# Altium schematic sheet Water_Level_Indicator_shematic.SchDoc
size A4; SheetNumber: 1; SheetTotal: 1; SPICEModelCacheLQCHODQK: <root> / <DocumentId>LQCHODQK</DocumentId> / </root>
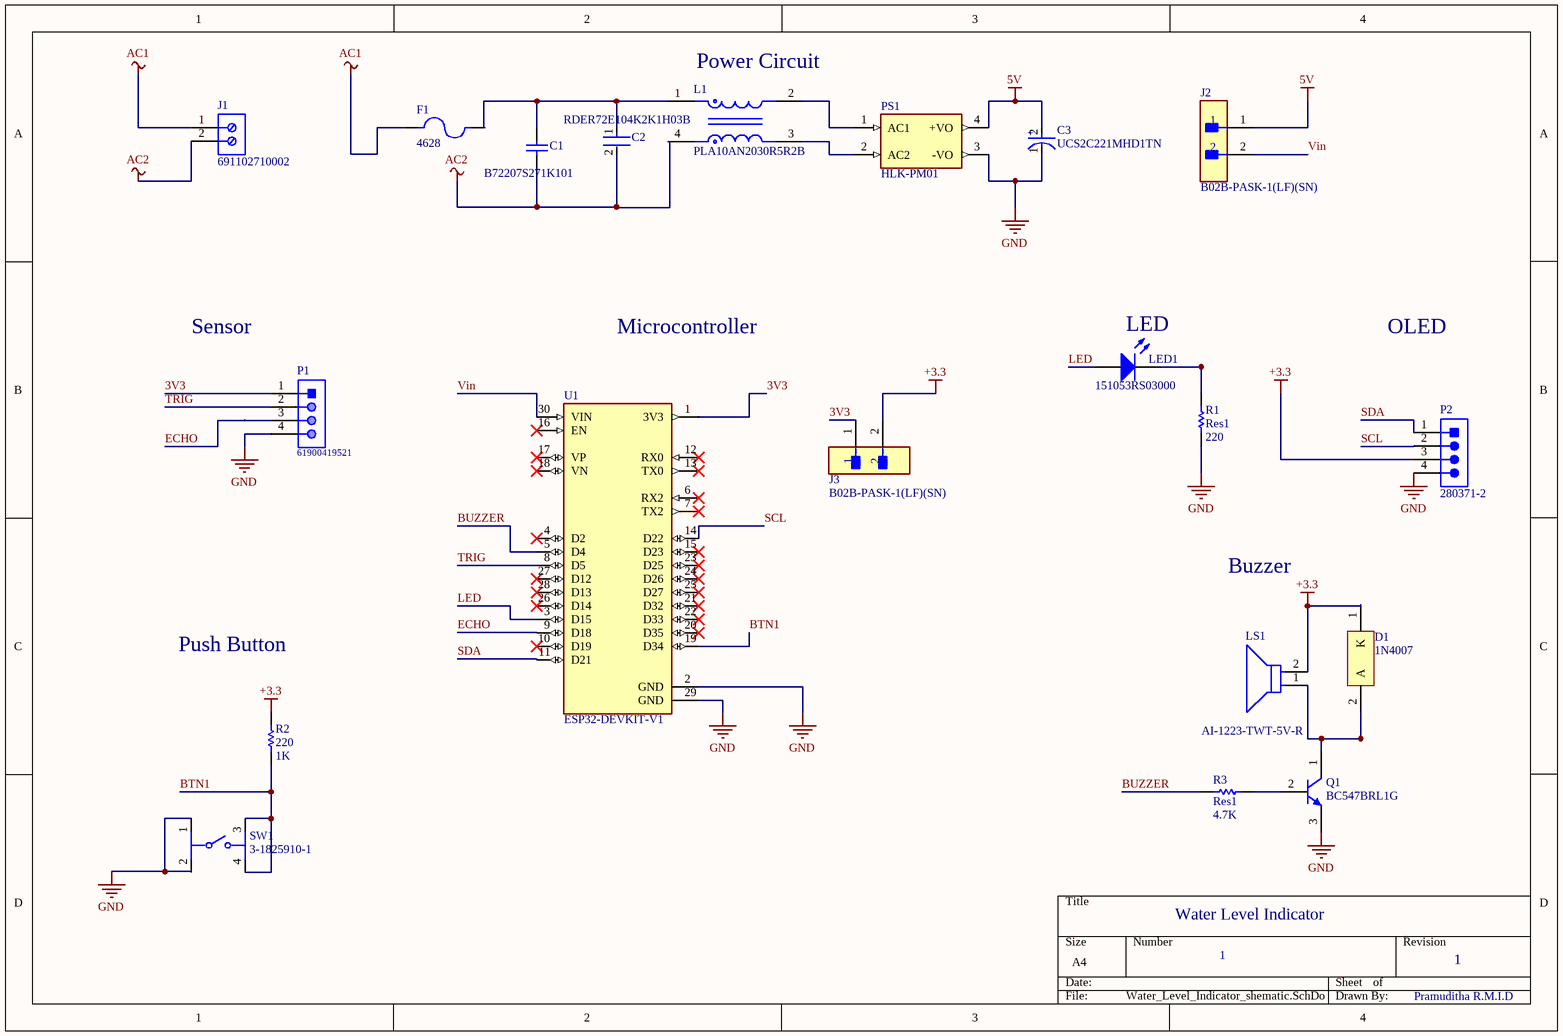
[diagram p0: Water_Level_Indicator_shematic.SchDoc]

## Parts
C1  B72207S271K101  [TDK-S07K275]
C2  RDER72E104K2K1H03B  [FP-RDE2M1-MFG]
C3  UCS2C221MHD1TN  [FP-UCS2C221MHD1TN-MFG]
D1  1N4007  [ONSC-AXIAL_LEAD-2-59-10_P]
F1  4628  [FUSE_4628]
J1  691102710002  [691102710002]
J2  B02B-PASK-1(LF)(SN)  [FP-B02B-PASK-1_LF_SN-MFG]
J3  B02B-PASK-1(LF)(SN)  [FP-B02B-PASK-1_LF_SN-MFG]
L1  PLA10AN2030R5R2B  [FP-PLA10A-PLH10A-MFG]
LED1  151053RS03000  [Type 5mm]
LS1  AI-1223-TWT-5V-R  [FP-AI-1223-TWT-5V-R-MFG]
P1  61900419521  [61900419521]
P2  280371-2  [TECO-280371-2_V]
PS1  HLK-PM01  [CONV_HLK-PM01]
Q1  BC547BRL1G  [ONSC-TO-92-3-29-11_AM_BL]
R1  Res1  value 220  [AXIAL-0.3]
R2  220  value 1K  [AXIAL-0.3]
R3  Res1  value 4.7K  [AXIAL-0.3]
SW1  3-1825910-1  [FP-3-1825910-1-MFG]
U1  ESP32-DEVKIT-V1  [MODULE_ESP32_DEVKIT_V1]

## Nets
5V: C3.2(A) J2.1 PS1.4(+VO)
+3.3: D1.1(K) J3.2 LS1.2(A) P2.3 R2.2
AC1: F1.1 J1.1
AC2: C1.1 C2.2 J1.2 L1.4
GND: C3.1(C) P1.4 P2.4 PS1.3(-VO) Q1.3(E) R1.2 SW1.1 SW1.2 U1.2(GND) U1.29(GND)
3V3: J3.1 P1.1 U1.1(3V3)
BTN1: R2.1 SW1.3 SW1.4 U1.19(D34)
BUZZER: R3.1 U1.5(D4)
ECHO: P1.3 U1.9(D18)
LED: LED1.2(A) U1.3(D15)
SCL: P2.2 U1.14(D22)
SDA: P2.1 U1.11(D21)
TRIG: P1.2 U1.8(D5)
Vin: J2.2 U1.30(VIN)
NetC1_2: C1.2 C2.1 F1.2 L1.1
NetD1_2: D1.2(A) LS1.1(C) Q1.1(C)
NetL1_2: L1.2 PS1.1(AC1)
NetL1_3: L1.3 PS1.2(AC2)
NetLED1_1: LED1.1(K) R1.1
NetQ1_2: Q1.2(B) R3.2

Not connected (* = marked no-connect by the designer): U1 4(D2)* 6(RX2)* 7(TX2)* 10(D19)* 12(RX0)* 13(TX0)* 15(D23)* 16(EN)* 17(VP)* 18(VN)* 20(D35)* 21(D32)* 22(D33)* 23(D25)* 24(D26)* 25(D27)* 26(D14)* 27(D12)* 28(D13)*

## Notes on the sheet
- (near L1) Power Circuit
- Sensor
- Microcontroller
- (near LED1) LED
- OLED
- Buzzer
- Push Button
- Water Level Indicator
- 1
- Pramuditha R.M.I.D
- (in symbol CMP-12462-000073-1) +

## Library data of the parts
C1 = CMP-2000-05910-1: Leaded Varistor, 110 pF, 275 Vrms, 1.2 KA, -40 to 85 degC, 2-Pin THD, RoHS, Bulk; Manufacturer: TDK; Current, Surge: 1200 / A; Power Rating: 0.25W(Max.)@+85°C; Voltage, Operating: 275Vrms@+85°C,350VDC@+85°C; Voltage, DC: 350 / VDC; Capacitance: 95 / pF; Temperature, Operating, Minimum: -40 / °C; Time, Response: 25ns(Max.); Voltage, Varistor: 430 / V; Voltage, AC: 275 / VAC; Energy Rating: 21 / Joules; Electric Strength: 2.5kV(RMS)(Min.); Temperature, Operating, Maximum: 85 / °C; Brand/Series: StandardSeries; Resistance, Insulation: 10Megohms(Min.); Type: MOV; Voltage, Clamping: 710 / V; Datasheet URL: https://product.tdk.com/search-template/en/documents/data_sheet/70/db/var_11/SIOV_Leaded_StandarD.pdf; Manufacturer URL: http://www.tdk.com/; Current, Peak: 1200 / A; Dimensions: 9.0mm(Max.)Dia.x4.4mm(Max.)Wx11.0mm(Max.)H; Package: Leads; Technology: MetalOxide; Mounting Technology: ThroughHole; Mounting Style: Leaded; Terminal Type: TinnedCopper; Datasheet Version: 12/2011; Package Reference: S07K275; Package Description: 2-Pin Through Hole Device, Dia 9 mm, Height 12 mm
C2 = CMP-06035-020184-1: Ceramic Capacitor 100nF ±10% 250V X7R Radial; Lead/Base Style: Kinked; Lead Diameter: 0.5mm; Lead Pitch: 0.197inch; Dielectric: X7R; Mount: Through Hole; Resistor Type: Ceramic; Height: 4mm; Width: 0.124inch; Length: 5.5mm; Case/Package: Radial; Packaging: Bulk; Max Operating Temperature: 125°C; Voltage Rating (DC): 250V; Package Quantity: 500; Min Operating Temperature: -55°C; Voltage Rating: 250V; Termination: Radial; Tolerance: 10%; Height - Seated (Max): 0.236inch; Capacitance: 100nF; Lead Free: Lead Free
C3 = CMP-12462-000073-1: CAP ALUM 220UF 20% 160V RADIAL; Ripple Current: 2.37A; Life (Hours): 10000Hour; Lead Diameter: 0.8mm; Mount: Through Hole; RoHS Compliant: Yes; Max Operating Temperature: 105°C; Radiation Hardening: No; Lead Pitch: 7.5mm; Case/Package: Radial; Min Operating Temperature: -40°C; Voltage Rating: 160V; Packaging: Cut Tape; Capacitance: 220uF; Tolerance: 20%; Diameter: 16mm; Package Quantity: 250; Height: 25mm; Series: UCS; Height - Seated (Max): 1.063inch; Termination: Radial
D1 = CMP-0902-00142-1: Standard Recovery Rectifier, 2-Pin Axial_Lead, Pb-Free, Bulk Bag; Manufacturer: On Semiconductor; IO(rec) Max (A): 1; IFSM Max (A): 30; VRRM Max (V): 1000; ComponentLink3URL: http://www.onsemi.cn/pub_link/Collateral/59-10.PDF; PackageVersion: Rev. U, 02/2005; PackageDescription: 2-Pin, Axial Lead, Diameter 2.35 mm; PackageReference: AXIAL_LEAD-2-59-10; RoHS: TRUE; PartNumber: 1N4007; Packing: Bulk Bag; DatasheetVersion: Rev. 13; ComponentLink3Description: Package Specification; ComponentLink1Description: Manufacturer URL; ComponentLink2URL: http://www.onsemi.com/pub_link/Collateral/1N4001-D.PDF; ComponentLink1URL: http://www.onsemi.com/; Type: Standard Recovery; ComponentLink2Description: Datasheet; Mounting Technology: Through Hole
F1 = 4628: 5mm Slim Line Fuse holder; MF: Keystone; Check_prices: https://www.snapeda.com/parts/4628/Keystone/view-part/?ref=eda; Value: *; Availability: In Stock; MP: 4628; Price: None; Package: None; SnapEDA_Link: https://www.snapeda.com/parts/4628/Keystone/view-part/?ref=snap; Purchase-URL: https://pricing.snapeda.com/search/part/4628/?ref=eda
J1 = CMP-1502-03258-1: Series 102 - 5.00 mm Horizontal Entry Modular with Pressure Clamp WR-TBL, 2 pin; Manufacturer: Wurth Elektronik; Pin Number: 2; Pitch: 5.00mm; Manufacturer URL: http://www.we-online.de; Mounting Technology: THT; Publisher: WurthElektronik; Packaging: Box; Package Reference: 691102710002; Datasheet URL: http://katalog.we-online.de/em/datasheet/6911027100xx.pdf; Operating Temperature: -40to105degC; Part Number: 691102710002
J2 J3 = CMP-17439-000415-1: CONN HEADER VERT 2POS 2MM; Number of Contacts: 2; Current Rating: 3A; Insulation Resistance: 1GR; Mated Stacking Heights: 14.9mm; Voltage Rating: 250V; Gender: Male; Pitch: 2mm; Orientation: Straight; Contact Finish - Mating: TIN; Mount: Through Hole; Contact Type: Male Pin; Number of Rows: 1; Fastening Type: Ramp; Series: PA; Connector Type: Header; Insulation Color: Natural; Flammability Rating: UL94 V-0; Material: Polybutylene; Contact Shape: Square; Contact Plating: Tin; Insulation Material: PBT; Max Operating Temperature: 85°C; Housing Color: White; Number of Positions: 2; Contact Material: Copper Alloy; Min Operating Temperature: -25°C; Lead Free: Lead Free; Contact Mating Length: 0.126inch; Termination: Solder; Packaging: Bulk; Color: Natural
L1 = CMP-06045-000412-1: Common Mode Choke Dual 20mH 0.5A 1.8Ω DCR Thru-Hole Bulk; Voltage Rating (DC): 300V; Lead/Base Style: Pin; RMS Current (Irms): 500mA; Shielding: Unshielded; DC Resistance (DCR): 100mR; Current Rating: 500uA; Number of Lines: 2; Lead Diameter: 0.9mm; Mount: Through Hole; Military Standard: Not; Min Operating Temperature: -25°C; REACH SVHC: No SVHC; Lead Free: Lead Free; Termination: Radial; Number of Pins: 4; Max DC Current: 500mA; Package Quantity: 1260; Lead Pitch: 13mm; Radiation Hardening: No; Inductance: 20mH; Length: 18mm; DC Current: 500mA; Max Operating Temperature: 120°C; Width: 0.63inch; Voltage Rating: 300V; Depth: 16mm; Height: 17.5mm; Packaging: Bulk; Insulation Resistance: 100MR; Voltage Rating (AC): 300V; Current: 500mA
LED1 = CMP-1489-00007-1: THT LED round mono-color waterclear,  WL-TMRW ,Red; Manufacturer: Wuerth Elektronik; PackageReference: Type 5mm; PartNumber: 151053RS03000; ComponentLink1URL: http://www.we-online.com; ComponentLink2Description: Datasheet; Emitting color: Red; ComponentLink2URL: http://katalog.we-online.de/pbs/datasheet/7448042001.pdfhttp://katalog.we-online.de/pbs/datasheet/7448042001.pdfhttp://katalog.we-online.de/pbs/datasheet/7448042001.pdfhttp://katalog.we-online.de/pbs/datasheet/151053RS03000.pdf; ComponentLink1Description: Manufacturer URL
LS1 = CMP-231724-000001-1: AUDIO MAGNETIC INDICATOR 3-7V TH; Input Type: DC; Bandwidth: 2.3kHz; Nominal Supply Voltage (DC): 5V; Max Supply Current: 30mA; Washable: Yes; Max Supply Voltage (DC): 7V; Min Supply Voltage: 3V; Series: AI; Width: 12mm; REACH SVHC: No SVHC; Contact Plating: Tin; Frequency: 2.3kHz; Operating Supply Current: 30mA; Weight: 0.01lb; Current Rating: 30mA; Mount: Through Hole; Packaging: Tray; Length: 12mm; Lead Free: Lead Free; Color: Black; Input Current: 30mA; Min Operating Temperature: -40°C; Self Resonant Frequency: 2.3kHz; Sensing Method: Magnetic; Voltage Rating (DC): 5V; Height: 9.5mm; Termination: PC Pins; Min Supply Voltage (DC): 3V; Package Quantity: 100; Max Supply Voltage: 7V; Diameter: 12mm; Max Operating Temperature: 85°C
P1 = CMP-1502-00601-1: Male Top Locking Header WR-WTB, THT, Right Angled, pitch 2.54 mm, 1 x 4 position; Manufacturer: Wurth Elektronik; Working Voltage: 250VAC; Contact Resistance: 20mOhm; Pitch: 2.54mm; Position: 1x4; Mounting Technology: THT; Package Reference: 61900419521; Publisher: WurthElektronik; Packaging: Bag; Datasheet URL: https://katalog.we-online.de/em/datasheet/6190xx19521.pdf; Part Number: 61900419521; Manufacturer URL: http://www.we-online.de; Gender: Male; Orientation: RightAngled; Operating Temperature: -40to105degC
P2 = CMP-2000-05548-1: Male Header, Pitch 2.54 mm, 1 x 4 Position, Height 12.8 mm, Tail Length 3.5 mm, -55 to 105 degC, RoHS, Bulk; Manufacturer: TE Connectivity; Pitch: 0.100"(2.54mm); Connector Type: Header,Shrouded; Other Names: 280371-2-ND / A106401; Number of Positions Loaded: All; Dynamic Catalog: AMPMODUModIISeries; Number of Positions: 4; 3D Model: 280371-2.pdf; Termination: Solder; Package Description: Male Header, Pitch 2.54 mm, 1 x 4 Position, Height 12.8 mm, Tail Length 3.5 mm; Datasheet Version: Rev. M1, 08/2016; Contact Mating Length: 0.260"(6.60mm); Datasheet URL: http://www.te.com/commerce/DocumentDelivery/DDEController?Action=showdoc&DocId=Customer+Drawing%7F280370%7FM1%7Fpdf%7FEnglish%7FENG_CD_280370_M1.pdf%7F280371-2; Mounting Technology: ThroughHole; Standard Package: 1,000; Contact Finish Thickness: 15µin(0.38µm); Contact Finish: Gold; Contact Type: MalePin; Packaging: Bulk; Mounting Type: ThroughHole; Number of Rows: 1; Family: RectangularConnectors-Headers,MalePins; Manufacturer URL: http://www.te.com/; Color: Black; RoHS Information: 280371-2StatementofCompliance; Package Reference: 280371-2; Category: Connectors,Interconnects; Series: AMPMODUModII
PS1 = HLK-PM01: The HLK-PM01 is a small size low cost AC to DC converter which can take in 110V/220V AC at 50/60 Hz and give 5V 3W output. The module is can be used in designs which run on 5V and needs to be powered form the AC mains.; MF: Hi-link; Package: None; Value: *; Price: None; Check_prices: https://www.snapeda.com/parts/hlk-pm01/Hi-link/view-part/?ref=eda; MP: hlk-pm01; Availability: Not in stock; SnapEDA_Link: https://www.snapeda.com/parts/hlk-pm01/Hi-link/view-part/?ref=snap
Q1 = CMP-1048-01605-1: Amplifier Transistor, NPN Silicon, 3-Pin TO-92, Pb-Free, Tape and Reel; Manufacturer: On Semiconductor; IC Continuous (A): 0.1; fT Min (MHz): 150; ComponentLink2URL: http://www.onsemi.com/pub_link/Collateral/BC546-D.PDF; ComponentLink1URL: http://www.onsemi.com/; ComponentLink2Description: Datasheet; RoHS: TRUE; ComponentLink3Description: Package Specification; ComponentLink1Description: Manufacturer URL; ComponentLink3URL: http://www.onsemi.com/pub_link/Collateral/MAC97-D.PDF; PackageDescription: 3-Pin Transistor Outline, Body 4.825 x 3.685 mm, Pitch 1.27 mm; Packing: Tape and Reel; PackageVersion: Rev. AM; Polarity: NPN; DatasheetVersion: Rev. 7; Mounting Technology: Through Hole; PackageReference: TO-92-3-29-11_AM_BL; PartNumber: BC547BRL1G
R1-R3 = Res1: Resistor; Published: 8-Jun-2000; LatestRevisionDate: 17-Jul-2002; LatestRevisionNote: Re-released for DXP Platform.; PackageReference: AXIAL-0.3; Publisher: Altium Limited; PackageDescription: Axial Device, Thru-Hole; 2 Leads; 0.3 in Pin Spacing
SW1 = CMP-03407-000001-1: SWITCH TACTILE SPST-NO 0.05A 24V; Manufacturer: TE Connectivity; Operating Force: 160gf; Contact Current Rating: 50mA; Contact Resistance: 100mΩ; Electromechanical Life: 100000Cycles; Device Class L1: Electromechanical; ComponentLink2URL: https://www.te.com/commerce/DocumentDelivery/DDEController?Action=srchrtrv&DocNm=1825910&DocType=Customer+Drawing&DocLang=English; Category: Switch; Device Class L2: Switches; Temperature: -35°C to +85°C; RoHS: TRUE; Mount: Through Hole; Manufacturer Part Number: 3-1825910-1; Automotive: No; Lead Free: Yes; Device Class L3: Tactile Switches; ComponentLink2Description: Datasheet; Temperature Range High: +85°C; Height: 17.3mm; Package: 0; Temperature Range Low: -35°C; Throw Configuration: SPST-NO; Digikey Description: SWITCH TACTILE SPST-NO 0.05A 24V; Octopart: https://octopart.com/3-1825910-1-te+connectivity-46506874
U1 = ESP32-DEVKIT-V1: Dual core, Wi-Fi: 2.4 GHz up to 150 Mbits/s,BLE (Bluetooth Low Energy) and legacy Bluetooth, 32 bits, Up to 240 MHz; MF: Do it; Price: None; Availability: Not in stock; Package: None; MP: ESP32-DEVKIT-V1; Value: *; SnapEDA_Link: https://www.snapeda.com/parts/ESP32-DEVKIT-V1/Do+it/view-part/?ref=snap; Check_prices: https://www.snapeda.com/parts/ESP32-DEVKIT-V1/Do+it/view-part/?ref=eda